# Altium project MSP430F2132 Demoboard.PrjPcb
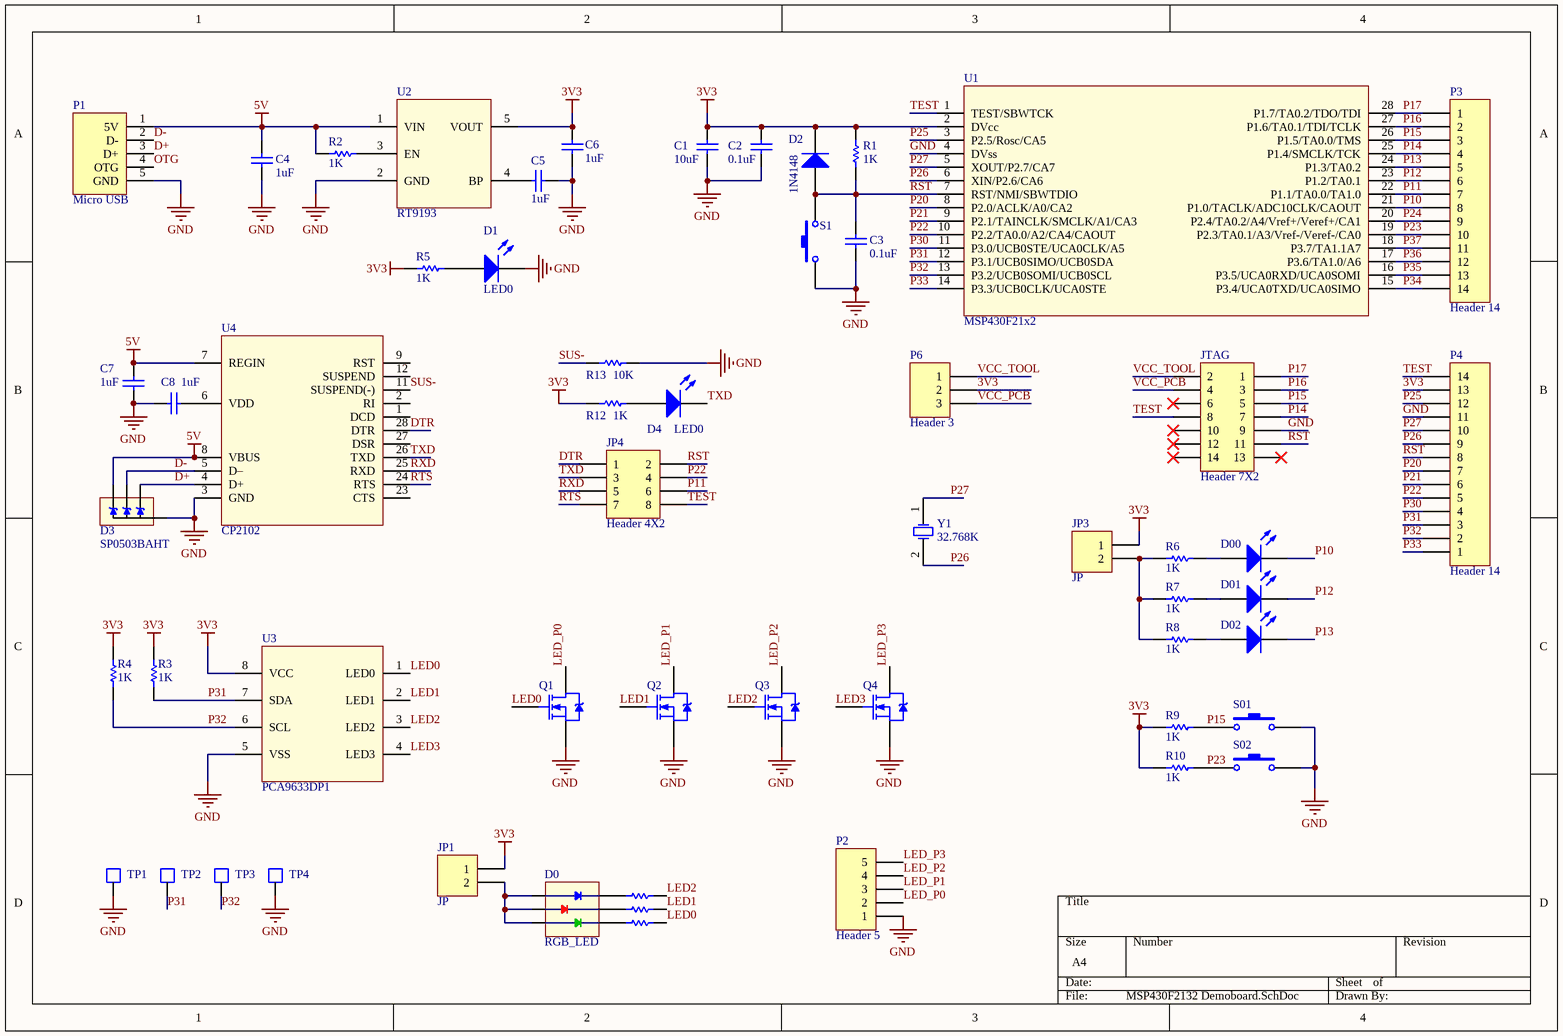
[diagram p0: MSP430F2132 Demoboard.SchDoc]
1 sheet, 56 parts. Net scope: global (net labels, ports and power ports of the same name join across sheets).
Board file: MSP430F2132.PcbDoc

## Sheet MSP430F2132 Demoboard.SchDoc
size A4; PageSetup: Record=PageOptions|CenterHorizontal=True|CenterVertical=True|PrintScale=1.00|XCorrection=1.00|YCorrection=1.00|PrintKind=0|BorderSize=5000000|LeftOffset=0|BottomOffset=0|Orientation=2|PaperLength=1000|PaperWidth=1000|Scale=100|PaperSource=7|PrintQuality=-3|MediaType=1|DitherType=10|PrintScaleMode=1|PaperKind=A4|PaperIndex=9

### Parts
C1  value 10uF  [D0603]  (hidden comment: Cap)
C2  value 0.1uF  [D0603]  (hidden comment: Cap)
C3  value 0.1uF  [D0603]  (hidden comment: Cap)
C4  value 1uF  [D0603]  (hidden comment: Cap)
C5  value 1uF  [D0603]  (hidden comment: Cap)
C6  value 1uF  [D0603]  (hidden comment: Cap)
C7  value 1uF  [D0603]  (hidden comment: Cap)
C8  value 1uF  [D0603]  (hidden comment: Cap)
D0  RGB_LED  [LED5050]
D00  LED0  [D0805_Diode]  (value not drawn)
D1  LED0  [D0805_Diode]
D01  LED0  [D0805_Diode]  (value not drawn)
D02  LED0  [D0805_Diode]  (value not drawn)
D2  1N4148  [D1206]
D3  SP0503BAHT  [SOT143_4]
D4  LED0  [D0805_Diode]
JP1  JP  [HDR1X2]
JP3  JP  [HDR1X2]
JP4  Header 4X2  [HDR2X4]
JTAG  Header 7X2  [HDR2X7]
P1  Micro USB  [Micro.Horn]
P2  Header 5  [HDR1X5]
P3  Header 14  [HDR1X14]
P4  Header 14  [HDR1X14]
P6  Header 3  [HDR1X3]
Q1  NMOS-2  [SOT23_N]  (value not drawn)
Q2  NMOS-2  [SOT23_N]  (value not drawn)
Q3  NMOS-2  [SOT23_N]  (value not drawn)
Q4  NMOS-2  [SOT23_N]  (value not drawn)
R00  Res1  [D0603]  (value not drawn)
R1  value 1K  [D0603]  (hidden comment: Res1)
R01  Res1  [D0603]  (value not drawn)
R2  value 1K  [D0603]  (hidden comment: Res1)
R02  Res1  [D0603]  (value not drawn)
R3  value 1K  [D0603]  (hidden comment: Res1)
R4  value 1K  [D0603]  (hidden comment: Res1)
R5  value 1K  [D0603]  (hidden comment: Res1)
R6  value 1K  [D0603]  (hidden comment: Res1)
R7  value 1K  [D0603]  (hidden comment: Res1)
R8  value 1K  [D0603]  (hidden comment: Res1)
R9  value 1K  [D0603]  (hidden comment: Res1)
R10  value 1K  [D0603]  (hidden comment: Res1)
R12  value 1K  [D0603]  (hidden comment: Res1)
R13  value 10K  [D0603]  (hidden comment: Res1)
S1  SW-PB  [SW_A]  (value not drawn)
S01  SW-PB  [SW_A]  (value not drawn)
S02  SW-PB  [SW_A]  (value not drawn)
TP1  TP  [TP0_8]  (value not drawn)
TP2  TP  [TP0_8]  (value not drawn)
TP3  TP  [TP0_8]  (value not drawn)
TP4  TP  [TP0_8]  (value not drawn)
U1  MSP430F21x2  [TSSOP28]
U2  RT9193  [SC70-5]
U3  PCA9633DP1  [TSSOP8]
U4  CP2102  [QFN28]
Y1  value 32.768K  [XTAL2X6]  (hidden comment: XTAL)

### Nets
3V3: C1.2 C2.2 C6.1 D2.2(K) JP1.1 JP3.1 P4.13 P6.2 R1.2 R3.1 R4.1 R5.2 R9.2 R10.2 R12.2 U1.2(DVcc) U2.5(VOUT) U3.8(VCC)
5V: C4.2 C7.1 D3.3(D3) P1.1(5V) R2.2 U2.1(VIN) U4.7(REGIN) U4.8(VBUS)
GND: C1.1 C2.1 C3.1 C4.1 C5.1 C6.2 C7.2 C8.1 D1.2(K) D3.1(GND) JTAG.9 P1.5(GND) P2.1 P4.11 Q1.3(S) Q2.3(S) Q3.3(S) Q4.3(S) R13.1 S1.1 S01.2 S02.2 TP1.1(TP) TP4.1(TP) U1.4(DVss) U2.2(GND) U3.5(VSS) U4.3(GND)
D+: D3.4(D1) P1.3(D+) U4.4(D+)
D-: D3.2(D2) P1.2(D-) U4.5(D–)
DTR: JP4.1 U4.28(DTR)
LED0: Q1.1(G) R02.2 U3.1(LED0)
LED1: Q2.1(G) R01.2 U3.2(LED1)
LED2: Q3.1(G) R00.2 U3.3(LED2)
LED3: Q4.1(G) U3.4(LED3)
LED_P0: P2.2 Q1.2(D)
LED_P1: P2.3 Q2.2(D)
LED_P2: P2.4 Q3.2(D)
LED_P3: P2.5 Q4.2(D)
OTG: P1.4(OTG)
P10: D00.2(K) P3.8 U1.21(P1.0/TACLK/ADC10CLK/CAOUT)
P11: JP4.6 P3.7 U1.22(P1.1/TA0.0/TA1.0)
P12: D01.2(K) P3.6 U1.23(P1.2/TA0.1)
P13: D02.2(K) P3.5 U1.24(P1.3/TA0.2)
P14: JTAG.7 P3.4 U1.25(P1.4/SMCLK/TCK)
P15: JTAG.5 P3.3 R9.1 S01.1 U1.26(P1.5/TA0.0/TMS)
P16: JTAG.3 P3.2 U1.27(P1.6/TA0.1/TDI/TCLK)
P17: JTAG.1 P3.1 U1.28(P1.7/TA0.2/TDO/TDI)
P20: P4.7 U1.8(P2.0/ACLK/A0/CA2)
P21: P4.6 U1.9(P2.1/TAINCLK/SMCLK/A1/CA3)
P22: JP4.4 P4.5 U1.10(P2.2/TA0.0/A2/CA4/CAOUT)
P23: P3.10 R10.1 S02.1 U1.19(P2.3/TA0.1/A3/Vref-/Veref-/CA0)
P24: P3.9 U1.20(P2.4/TA0.2/A4/Vref+/Veref+/CA1)
P25: P4.12 U1.3(P2.5/Rosc/CA5)
P26: P4.9 U1.6(XIN/P2.6/CA6) Y1.2(OSC2)
P27: P4.10 U1.5(XOUT/P2.7/CA7) Y1.1(OSC1)
P30: P4.4 U1.11(P3.0/UCB0STE/UCA0CLK/A5)
P31: P4.3 R3.2 TP2.1(TP) U1.12(P3.1/UCB0SIMO/UCB0SDA) U3.7(SDA)
P32: P4.2 R4.2 TP3.1(TP) U1.13(P3.2/UCB0SOMI/UCB0SCL) U3.6(SCL)
P33: P4.1 U1.14(P3.3/UCB0CLK/UCA0STE)
P34: P3.14 U1.15(P3.4/UCA0TXD/UCA0SIMO)
P35: P3.13 U1.16(P3.5/UCA0RXD/UCA0SOMI)
P36: P3.12 U1.17(P3.6/TA1.0/A6)
P37: P3.11 U1.18(P3.7/TA1.1A7)
RST: C3.2 D2.1(A) JP4.2 JTAG.11 P4.8 R1.1 S1.2 U1.7(RST/NMI/SBWTDIO)
RTS: JP4.7 U4.24(RTS)
RXD: JP4.5 U4.25(RXD)
SUS-: R13.2 U4.11(SUSPEND(-))
TEST: JP4.8 JTAG.8 P4.14 U1.1(TEST/SBWTCK)
TXD: D4.2(K) JP4.3 U4.26(TXD)
VCC_PCB: JTAG.4 P6.3
VCC_TOOL: JTAG.2 P6.1
NetC5_2: C5.2 U2.4(BP)
NetC8_2: C8.2 U4.6(VDD)
NetD0_1: D0.1(R+) D0.2(G+) D0.3(B+) JP1.2
NetD00_1: D00.1(A) R6.1
NetD0_4: D0.4(B-) R02.1
NetD0_5: D0.5(G-) R01.1
NetD0_6: D0.6(R-) R00.1
NetD1_1: D1.1(A) R5.1
NetD01_1: D01.1(A) R7.1
NetD02_1: D02.1(A) R8.1
NetD4_1: D4.1(A) R12.1
NetJP3_2: JP3.2 R6.2 R7.2 R8.2
NetR2_1: R2.1 U2.3(EN)

Not connected (* = marked no-connect by the designer): JTAG 6* 10* 12* 13* 14*; U4 1(DCD) 2(RI) 9(RST) 12(SUSPEND) 23(CTS) 27(DSR)

### Library data of the parts
C1-C8 = Cap: Capacitor; Published: 8-Jun-2000; LatestRevisionDate: 17-Jul-2002; LatestRevisionNote: Re-released for DXP Platform.; PackageReference: RAD-0.3; Publisher: Altium Limited; PackageDescription: Radial Cap, Thru-Hole; 2 Leads; 0.3 in Pin Spacing
D00 D1 D01 D02 D4 = LED0: Typical INFRARED GaAs LED; Published: 8-Jun-2000; LatestRevisionDate: 08-Jul-2005; LatestRevisionNote: Mech Layer 1 removed.; PackageReference: LED-0; Publisher: Altium Limited; PackageDescription: LED; 2 Leads
D2 = Diode 1N4148: High Conductance Fast Diode; Published: 8-Jun-2000; LatestRevisionDate: 17-Jul-2002; LatestRevisionNote: Re-released for DXP Platform.; DatasheetVersion: 1997; PackageReference: DO-35; Publisher: Altium Limited; PackageDescription: Diode, Axial; Body 3.8 x 1.9 mm (LxDia. max), Lead Dia. 0.53 mm (max); Code_JEDEC: DO-204-AH; ComponentLink1Description: Manufacturer Link; ComponentLink1URL: http://www.fairchildsemi.com/; ComponentLink2Description: Datasheet; ComponentLink2URL: http://www.fairchildsemi.com/ds/1N%2F1N4148.pdf
JP1 JP3 = Header 2: Header, 2-Pin; LatestRevisionDate: 17-Jul-2002; LatestRevisionNote: Re-released for DXP Platform.; Publisher: Altium Limited
JP4 = Header 4X2: Header, 4-Pin, Dual row; LatestRevisionDate: 17-Jul-2002; LatestRevisionNote: Re-released for DXP Platform.; Publisher: Altium Limited
JTAG = Header 7X2: Header, 7-Pin, Dual row; LatestRevisionDate: 17-Jul-2002; LatestRevisionNote: Re-released for DXP Platform.; Publisher: Altium Limited
P1 = Micro USB Horn: MIcro USB Connector Horn
P2 = Header 5: Header, 5-Pin; LatestRevisionDate: 17-Jul-2002; LatestRevisionNote: Re-released for DXP Platform.; Publisher: Altium Limited
P3 P4 = Header 14: Header, 14-Pin; LatestRevisionDate: 17-Jul-2002; LatestRevisionNote: Re-released for DXP Platform.; Publisher: Altium Limited
P6 = Header 3: Header, 3-Pin; LatestRevisionDate: 17-Jul-2002; LatestRevisionNote: Re-released for DXP Platform.; Publisher: Altium Limited
Q1-Q4 = NMOS-2: N-Channel Power MOSFET; Note: Pin 2 is electrically connected to pin 4.; Published: 8-Jun-2000; LatestRevisionDate: 17-Jul-2002; LatestRevisionNote: Re-released for DXP Platform.; DatasheetVersion: PD-9.814; PackageVersion: Feb-1997; PackageReference: TO-220AB; Publisher: Altium Limited; PackageDescription: TO, Thru-Hole, Vertical, Heatsink Mounted; 3 In-Line Leads; Pitch 2.54 mm; ComponentLink1Description: Manufacturer Link; ComponentLink1URL: http://www.irf.com/
R00 R01 R02 = Res1: Resistor; Value: 1K; Published: 8-Jun-2000; LatestRevisionDate: 17-Jul-2002; LatestRevisionNote: Re-released for DXP Platform.; PackageReference: AXIAL-0.3; Publisher: Altium Limited; PackageDescription: Axial Device, Thru-Hole; 2 Leads; 0.3 in Pin Spacing
R1-R10 R12 R13 = Res1: Resistor; Published: 8-Jun-2000; LatestRevisionDate: 17-Jul-2002; LatestRevisionNote: Re-released for DXP Platform.; PackageReference: AXIAL-0.3; Publisher: Altium Limited; PackageDescription: Axial Device, Thru-Hole; 2 Leads; 0.3 in Pin Spacing
S1 S01 S02 = SW-PB: Switch; Published: 24-Mar-1999; LatestRevisionDate: 17-Jul-2002; LatestRevisionNote: Re-released for DXP Platform.; PackageReference: SPST-2; Publisher: Altium Limited; PackageDescription: Switch; 2 Leads
U1 = MSP430F21x2_PW
U2 = RT9193: 3V3 Voltage Regulator
Y1 = XTAL: Crystal Oscillator; Published: 8-Jun-2000; LatestRevisionDate: 17-Jul-2002; LatestRevisionNote: Re-released for DXP Platform.; PackageReference: R38; Publisher: Altium Limited; PackageDescription: Crystal, Thru-Hole; 2 Leads; Body 3.1 x 8.2 mm (Dia.xH)